# EAGLE design node (EAGLE 6.6.0)
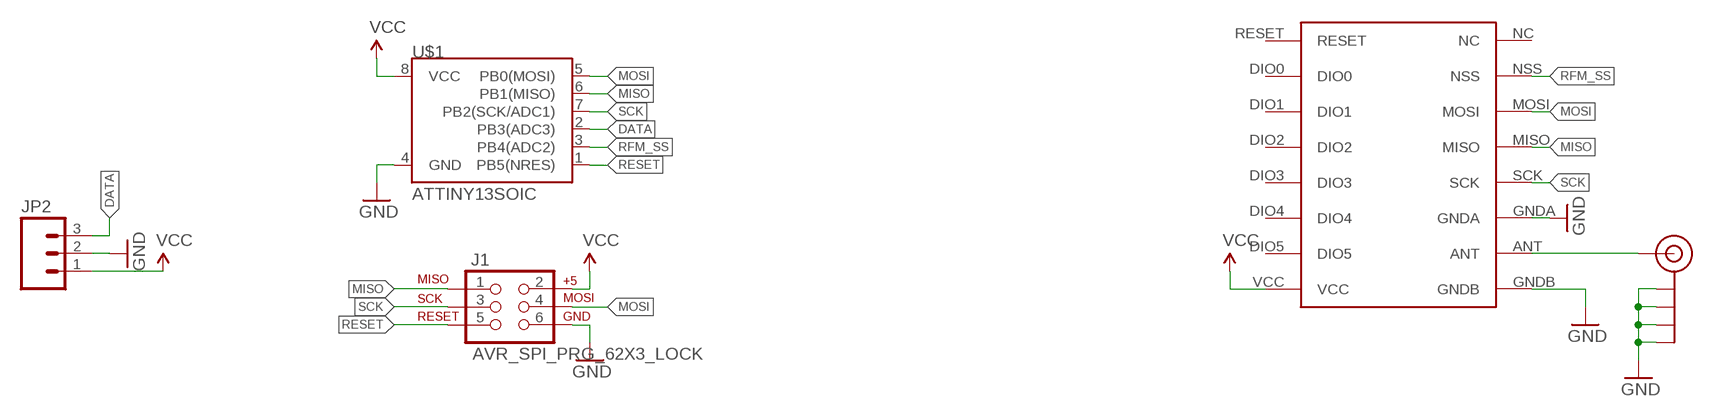
[diagram p0: schematic, sheet 1]

## Parts
J1  AVR_SPI_PRG_62X3_LOCK  [2X3_LOCK]
J$1  SMA_EDGE  [SMA-EDGE]
JP2  M03PTH  [1X03]
U$1  ATTINY13SOIC  [SO08]
U$4  RFM69HW  [RFM]

## Nets
DATA: JP2.3 U$1.2(PB3(ADC3))
GND: J1.6 J$1.GND@0(GND) J$1.GND@1(GND) J$1.GND@2(GND) J$1.GND@3(GND) JP2.2 U$1.4(GND) U$4.GNDA U$4.GNDB
MISO: J1.1 U$1.6(PB1(MISO)) U$4.MISO
MOSI: J1.4 U$1.5(PB0(MOSI)) U$4.MOSI
N$1: J$1.SIG(SIGNAL) U$4.ANT
RESET: J1.5 U$1.1(PB5(NRES))
RFM_SS: U$1.3(PB4(ADC2)) U$4.NSS
SCK: J1.3 U$1.7(PB2(SCK/ADC1)) U$4.SCK
VCC: J1.2 JP2.1 U$1.8(VCC) U$4.VCC
Unconnected: U$4.DIO0 U$4.DIO1 U$4.DIO2 U$4.DIO3 U$4.DIO4 U$4.DIO5 U$4.NC U$4.RESET

## Library data of the parts
J1 = SparkFun-Connectors:AVR_SPI_PRG_6: AVR ISP 6 Pin This is the reduced ISP connector for AVR programming. Common on Arduino. This footprint will take up less PCB space and can be used with a 10-pin to 6-pin adapter such as SKU: BOB-08508 **Special note about "TEST_POINT" package. The stop mask is on the top side, so if you want your programming test points to be on the bottom of your board, make sure to place this package on the bottom side of the board. This also ensure that the orientation to program from the bottom side will be correct.
J$1 = jonsowman:SMA_EDGE: SMA Antenna Connector End launch SMA connector. The paste layer has been removed so that the connector can be hand soldered onto the board after reflow.
JP2 = SparkFun-Connectors:M03: Header 3 Standard 3-pin 0.1" header. Use with straight break away headers (SKU : PRT-00116), right angle break away headers (PRT-00553), swiss pins (PRT-00743), machine pins (PRT-00117), and female headers (PRT-00115). Molex polarized connector foot print use with SKU : PRT-08232 with associated crimp pins and housings.
U$1 = SparkFun-DigitalIC:ATTINY13: Atmel 8-pin 1kB flash uC
U$4 = hoperf:RFM69HW

## Board
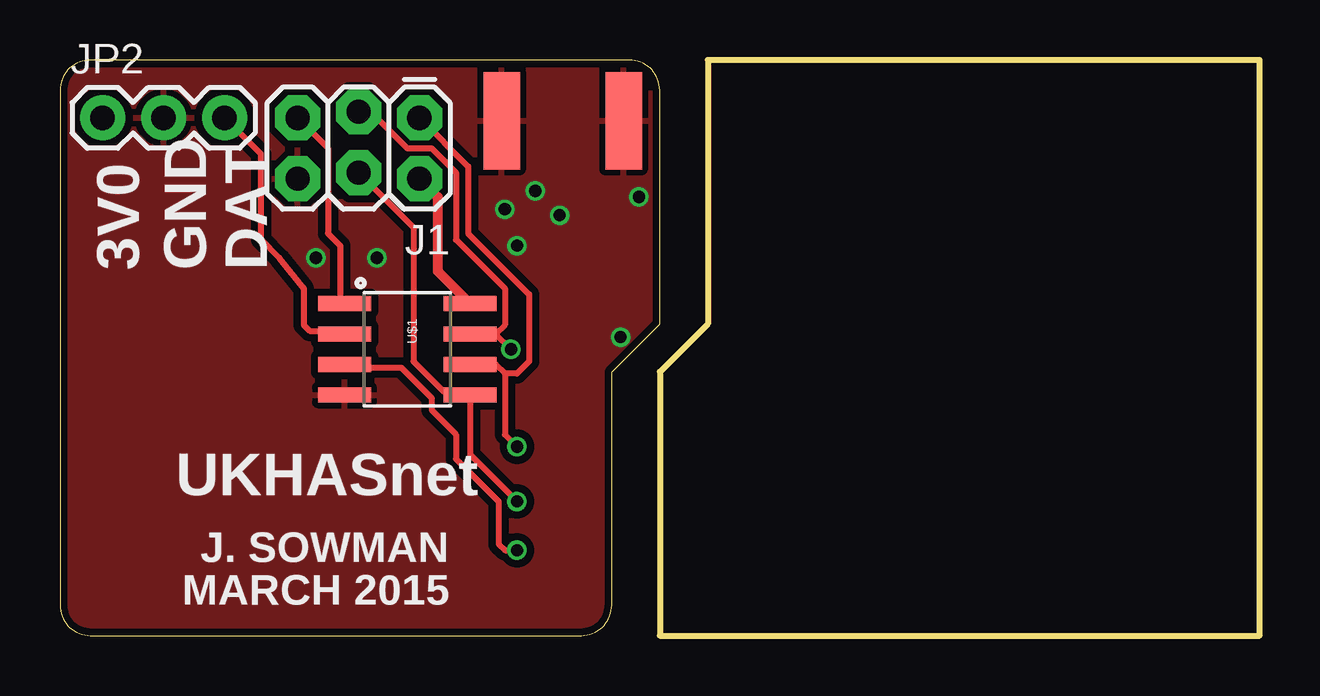
[diagram p1: board, top side]
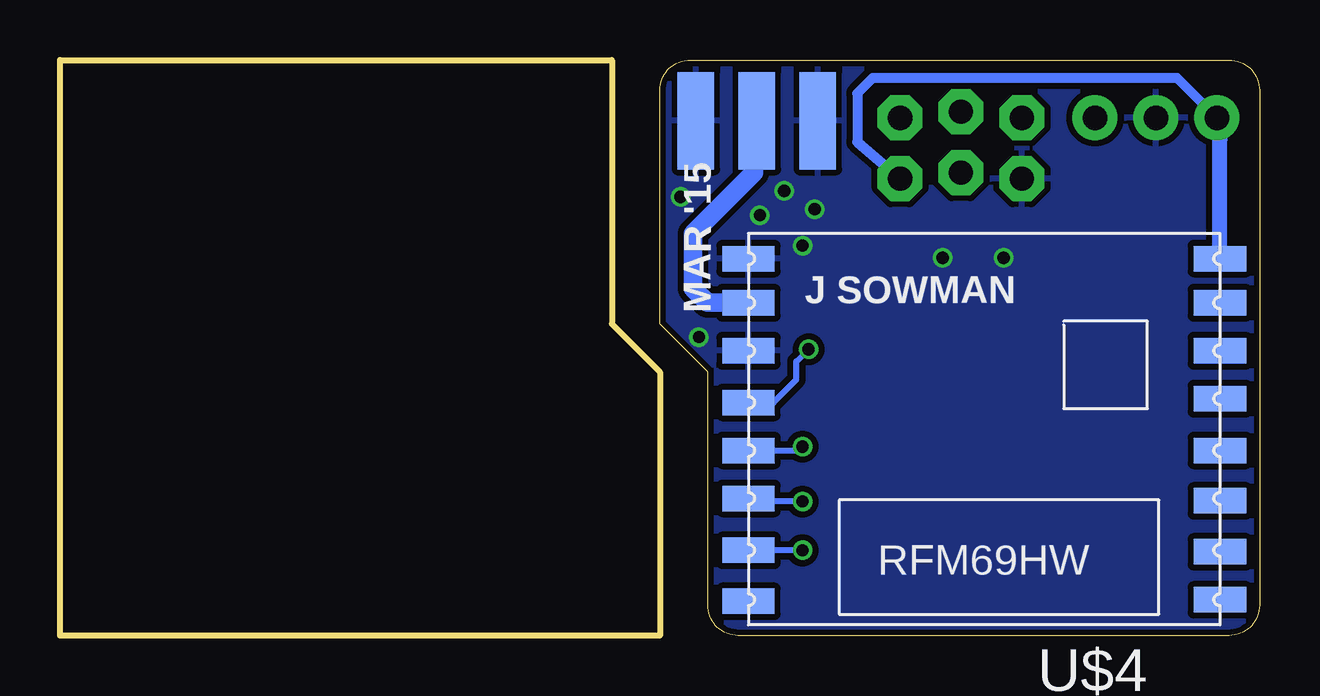
[diagram p2: board, bottom side, seen from below]

Size 50 x 24 mm. Coordinates in mm from the lower left corner, seen from the top.
Outline: 25,13 25,22.73 arc90 23.73,24 1.27,24 arc90 0,22.73 0,1.27 arc90 1.27,0 21.73,0 arc90 23,1.27 23,11 25,13
Outline: 27,24 27,13 25,11 25,0 50,0 50,24 27,24
Copper layers (1*16): Top 0.035mm / dielectric 1.5mm / Bottom 0.035mm
Design rules "SeeedStudio_rule_no_angle_090911": minimum track width 6mil, minimum drill 12mil, track to track 6mil, track to pad 6mil, pad to pad 6mil, via to via 6mil, smd to smd 0mil, copper to edge 10mil, drill to drill 10mil, minimum pad ring 10mil, minimum via ring 6mil, stop-mask expansion 2mil, vias tented up to drill 100mil, thermal gap 10mil

### Footprints (pad centres in the part's own frame; a part is rotated, then mirrored left to right if it is on the bottom)
2X3_LOCK = drill 1.016 pad 1.88 octagon: 1 0,0; 2 0,2.54; 3 2.54,-0.254; 4 2.54,2.286; 5 5.08,0; 6 5.08,2.54
SMA-EDGE = smd 1.524 x 4.064: GND@0 0,0; GND@1 5.08,0; SIG 2.54,0 | smd 1.524 x 4.064 bottom: GND@2 0,0; GND@3 5.08,0
1X03 = drill 1.016 pad 1.88: 1 0,0; 2 2.54,0; 3 5.08,0
SO08 = smd 0.61 x 2.21: 1 -1.905,-2.616; 2 -0.635,-2.616; 3 0.635,-2.616; 4 1.905,-2.616; 5 1.905,2.616; 6 0.635,2.616; 7 -0.635,2.616; 8 -1.905,2.616
RFM = smd 2.184 x 1.067: ANT 19.651,2.889; DIO0 0,13.27; DIO1 0,11.143; DIO2 0,9.047; DIO3 0,6.889; DIO4 0,4.889; DIO5 0,2.889; GNDA 19.651,4.889; GNDB 19.651,1.048; MISO 19.651,9.047; MOSI 19.651,11.047; NC 19.651,15.334; NSS 19.651,13.206; RESET 0,15.27; SCK 19.651,7.048; VCC 0,1.048

### Placement (x,y rotation side)
J1  14.99,21.59 180 top
J$1  23.5,21.46 0 bottom
JP2  1.78,21.59 0 top
U$1  14.48,11.94 270 top
U$4  1.65,16.76 180 bottom

### Tracks (layer width: path | path; a pad name or v marks a point on that pad's centre or on a via)
DATA
  Top 0.254: U$1.2 11.73,12.7 10.41,12.7 10.16,12.95 10.16,14.48 9.14,15.75 8.38,16.51 8.38,20.07 JP2.3
GND  (via drill 0.51 pad 0.3)
  other vias: 13.21,15.75 10.67,15.75 19.81,18.54 20.83,17.53 24.13,18.29 23.37,12.45 19.05,16.26 18.54,17.78
  pour Top (isolate 0.305): 0,0 23.11,0 23.11,10.92 23.11,11.18 24.89,12.95 24.89,23.88 0,23.88
  pour Bottom (isolate 0.254): 0,23.88 0,0 23.11,0 23.11,11.18 24.89,12.95 24.89,24.13 0.25,24.13 arc90
MISO  (via drill 0.51 pad 0.3)
  Top 0.254: U$1.6 18.16,11.3 18.54,10.92 | 18.54,10.92 18.54,8.38 v19.05,7.87 | 18.54,10.92 19.05,10.92 19.56,11.43 19.56,14.22 17.02,16.76 17.02,19.56 J1.1
  Bottom 0.254: U$4.MISO 19.21,7.72 v19.05,7.87
MOSI  (via drill 0.51 pad 0.3)
  Top 0.254: v19.05,5.59 17.09,7.54 U$1.5 16.97,10.16 16,10.16 14.73,11.43 14.73,17.02 J1.4
  Bottom 0.254: v19.05,5.59 21.17,5.59 U$4.MOSI
N$1
  Bottom 0.762: U$4.ANT 23.02,13.88 23.62,14.48 23.62,16.76 21.08,19.3 21.08,21.34 J$1.SIG
RESET
  Top 0.254: 11.99,13.72 U$1.1 | U$1.1 11.94,13.92 | J1.5 11.18,20.32 11.18,16.76 11.68,16.26 11.68,14.02 U$1.1
RFM_SS  (via drill 0.51 pad 0.3)
  Top 0.254: U$1.3 11.99,11.18 14.22,11.18 15.49,9.91 15.49,9.4 16.51,8.38 16.51,7.37 18.29,5.59 18.29,3.81 18.54,3.56 v19.05,3.56
  Bottom 0.254: v19.05,3.56 U$4.NSS
SCK  (via drill 0.51 pad 0.3)
  Top 0.254: J1.3 12.95,21.84 14.48,20.32 15.49,20.32 16.51,19.3 16.51,16.51 18.54,14.48 18.54,12.95 18.16,12.57 | 18.16,12.57 18.03,12.45 17.22,12.45 U$1.7 | v18.8,11.94 18.16,12.57
  Bottom 0.254: U$4.SCK 20.26,9.72 19.3,10.67 19.3,11.43 v18.8,11.94
VCC
  Top 0.406: J1.2 15.75,18.29 15.75,15.19 U$1.8
  Bottom 0.406: J1.2 16.76,20.57 16.76,22.61 16.13,23.24 3.43,23.24 JP2.1
  Bottom 0.635: U$4.VCC 1.65,20.7 JP2.1

### Text on the board
tPlace: 3V0 | GND | DAT | UKHASnet | J. SOWMAN | MARCH 2015
bPlace: J SOWMAN | MAR '15